# EAGLE schematic cable-adapter (EAGLE 6.5.0)
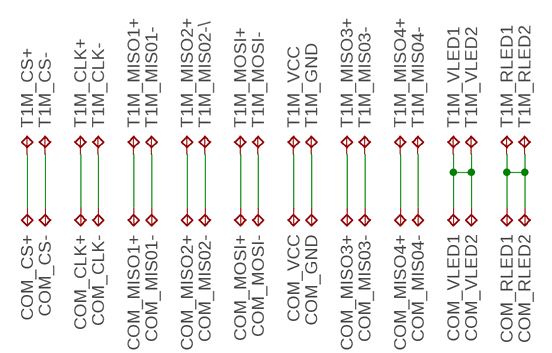
[diagram p0: schematic, sheet 1]

## Parts
COM_CLK+  TP_SPI_WIRE+  [SPI_WIRE+]
COM_CLK-  TP_SPI_WIRE+  [SPI_WIRE+]
COM_CS+  TP_SPI_WIRE+  [SPI_WIRE+]
COM_CS-  TP_SPI_WIRE+  [SPI_WIRE+]
COM_GND  TP_SPI_WIRE+  [SPI_WIRE+]
COM_MIS01-  TP_SPI_WIRE+  [SPI_WIRE+]
COM_MIS02-  TP_SPI_WIRE+  [SPI_WIRE+]
COM_MIS03-  TP_SPI_WIRE+  [SPI_WIRE+]
COM_MIS04-  TP_SPI_WIRE+  [SPI_WIRE+]
COM_MISO1+  TP_SPI_WIRE+  [SPI_WIRE+]
COM_MISO2+  TP_SPI_WIRE+  [SPI_WIRE+]
COM_MISO3+  MISO3+  TP_SPI_WIRE+  [SPI_WIRE+]
COM_MISO4+  TP_SPI_WIRE+  [SPI_WIRE+]
COM_MOSI+  TP_SPI_WIRE+  [SPI_WIRE+]
COM_MOSI-  TP_SPI_WIRE+  [SPI_WIRE+]
COM_RLED1  TP_SPI_WIRE+  [SPI_WIRE+]
COM_RLED2  TP_SPI_WIRE+  [SPI_WIRE+]
COM_VCC  TP_SPI_WIRE+  [SPI_WIRE+]
COM_VLED1  TP_SPI_WIRE+  [SPI_WIRE+]
COM_VLED2  TP_SPI_WIRE+  [SPI_WIRE+]
T1M_CLK+  TP_SPI_WIRE+  [SPI_WIRE+]
T1M_CLK-  TP_SPI_WIRE+  [SPI_WIRE+]
T1M_CS+  TP_SPI_WIRE+  [SPI_WIRE+]
T1M_CS-  TP_SPI_WIRE+  [SPI_WIRE+]
T1M_GND  TP_SPI_WIRE+  [SPI_WIRE+]
T1M_MIS01-  TP_SPI_WIRE+  [SPI_WIRE+]
T1M_MIS02-\  TP_SPI_WIRE+  [SPI_WIRE+]
T1M_MIS03-  TP_SPI_WIRE+  [SPI_WIRE+]
T1M_MIS04-  TP_SPI_WIRE+  [SPI_WIRE+]
T1M_MISO1+  TP_SPI_WIRE+  [SPI_WIRE+]
T1M_MISO2+  TP_SPI_WIRE+  [SPI_WIRE+]
T1M_MISO3+  TP_SPI_WIRE+  [SPI_WIRE+]
T1M_MISO4+  TP_SPI_WIRE+  [SPI_WIRE+]
T1M_MOSI+  TP_SPI_WIRE+  [SPI_WIRE+]
T1M_MOSI-  TP_SPI_WIRE+  [SPI_WIRE+]
T1M_RLED1  TP_SPI_WIRE+  [SPI_WIRE+]
T1M_RLED2  TP_SPI_WIRE+  [SPI_WIRE+]
T1M_VCC  TP_SPI_WIRE+  [SPI_WIRE+]
T1M_VLED1  TP_SPI_WIRE+  [SPI_WIRE+]
T1M_VLED2  TP_SPI_WIRE+  [SPI_WIRE+]

## Nets
+LED: COM_VLED1.P$1(TP) COM_VLED2.P$1(TP) T1M_VLED1.P$1(TP) T1M_VLED2.P$1(TP)
-LED: COM_RLED1.P$1(TP) COM_RLED2.P$1(TP) T1M_RLED1.P$1(TP) T1M_RLED2.P$1(TP)
CLK+: COM_CLK+.P$1(TP) T1M_CLK+.P$1(TP)
CLK-: COM_CLK-.P$1(TP) T1M_CLK-.P$1(TP)
CS+: COM_CS+.P$1(TP) T1M_CS+.P$1(TP)
CS-: COM_CS-.P$1(TP) T1M_CS-.P$1(TP)
GND: COM_GND.P$1(TP) T1M_GND.P$1(TP)
MIS02-: COM_MIS02-.P$1(TP) T1M_MIS02-\.P$1(TP)
MIS02-1: COM_MIS04-.P$1(TP) T1M_MIS04-.P$1(TP)
MISO1+: COM_MISO1+.P$1(TP) T1M_MISO1+.P$1(TP)
MISO1+1: COM_MISO3+.P$1(TP) T1M_MISO3+.P$1(TP)
MISO1-: COM_MIS01-.P$1(TP) T1M_MIS01-.P$1(TP)
MISO1-1: COM_MIS03-.P$1(TP) T1M_MIS03-.P$1(TP)
MISO2+: COM_MISO2+.P$1(TP) T1M_MISO2+.P$1(TP)
MISO2+1: COM_MISO4+.P$1(TP) T1M_MISO4+.P$1(TP)
MOSI+: COM_MOSI+.P$1(TP) T1M_MOSI+.P$1(TP)
MOSI-: COM_MOSI-.P$1(TP) T1M_MOSI-.P$1(TP)
VCC: COM_VCC.P$1(TP) T1M_VCC.P$1(TP)

## Library data of the parts
COM_CLK+ COM_CLK- COM_CS+ COM_CS- COM_GND COM_MIS01- COM_MIS02- COM_MIS03- COM_MIS04- COM_MISO1+ COM_MISO2+ COM_MISO3+ COM_MISO4+ COM_MOSI+ COM_MOSI- COM_RLED1 COM_RLED2 COM_VCC COM_VLED1 COM_VLED2 T1M_CLK+ T1M_CLK- T1M_CS+ T1M_CS- T1M_GND T1M_MIS01- T1M_MIS02-\ T1M_MIS03- T1M_MIS04- T1M_MISO1+ T1M_MISO2+ T1M_MISO3+ T1M_MISO4+ T1M_MOSI+ T1M_MOSI- T1M_RLED1 T1M_RLED2 T1M_VCC T1M_VLED1 T1M_VLED2 = jonnew:TP: Test pad